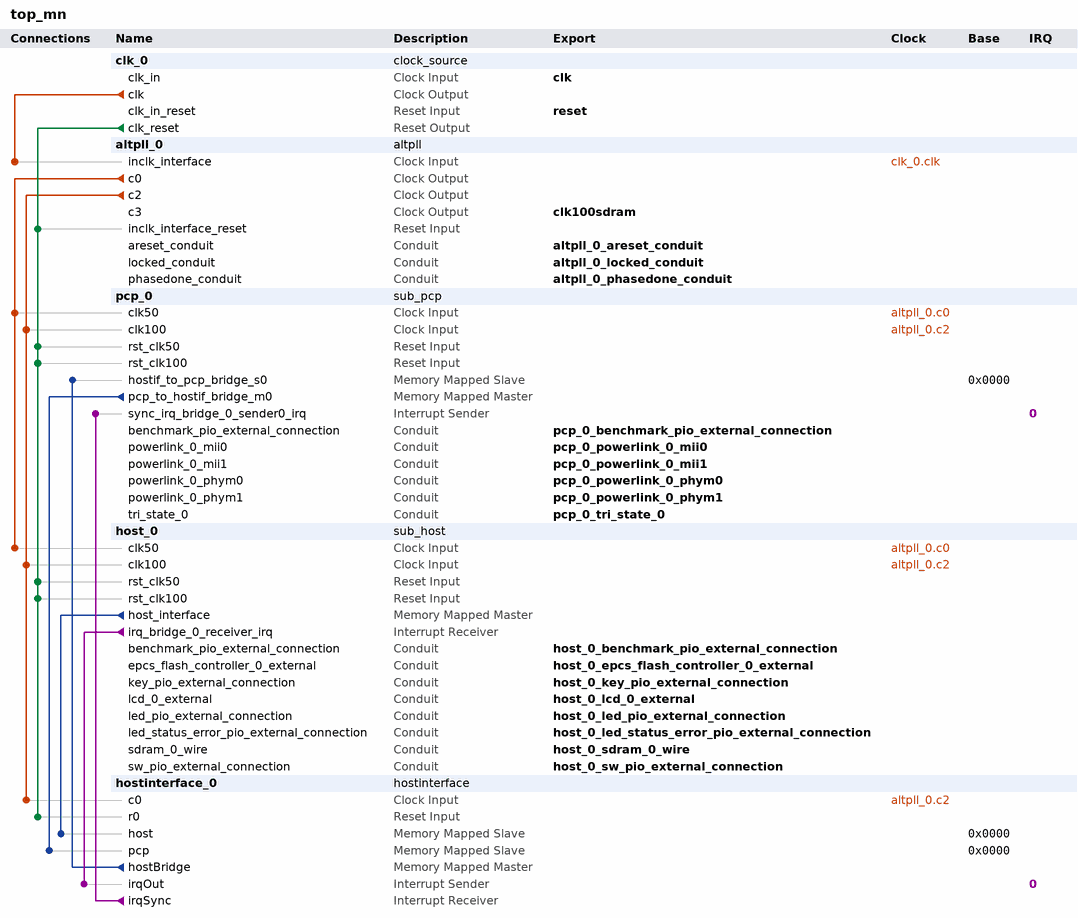
[diagram p0: system contents]
# Platform Designer (Qsys) system top_mn, Cyclone IV E EP4CE115F29C7
# Parameters at their usual value, and those the tool derives, are not listed.
package require -exact qsys 12.1
create_system top_mn
set_project_property DEVICE_FAMILY {Cyclone IV E}
set_project_property DEVICE EP4CE115F29C7

add_instance clk_0 clock_source 12.1
set_instance_parameter_value clk_0 clockFrequency 50000000

add_instance altpll_0 altpll 12.1
set_instance_parameter_value altpll_0 INCLK0_INPUT_FREQUENCY 20000
set_instance_parameter_value altpll_0 CLK0_MULTIPLY_BY 1
set_instance_parameter_value altpll_0 CLK2_MULTIPLY_BY 2
set_instance_parameter_value altpll_0 CLK3_MULTIPLY_BY 2
set_instance_parameter_value altpll_0 CLK0_DIVIDE_BY 1
set_instance_parameter_value altpll_0 CLK2_DIVIDE_BY 1
set_instance_parameter_value altpll_0 CLK3_DIVIDE_BY 1
set_instance_parameter_value altpll_0 CLK2_PHASE_SHIFT 0
set_instance_parameter_value altpll_0 CLK3_PHASE_SHIFT -1389
set_instance_parameter_value altpll_0 CLK2_DUTY_CYCLE 50
set_instance_parameter_value altpll_0 CLK3_DUTY_CYCLE 50
set_instance_parameter_value altpll_0 PORT_clk1 PORT_UNUSED
set_instance_parameter_value altpll_0 PORT_clk2 PORT_USED
set_instance_parameter_value altpll_0 PORT_clk3 PORT_USED
set_instance_parameter_value altpll_0 PORT_ARESET PORT_UNUSED
set_instance_parameter_value altpll_0 PORT_LOCKED PORT_USED

add_instance pcp_0 sub_pcp 1.0

add_instance host_0 sub_host 1.0

add_instance hostinterface_0 hostinterface 0.0.1
set_instance_parameter_value hostinterface_0 sys_uniqueId 0
set_instance_parameter_value hostinterface_0 gui_interfaceTyp 0
set_instance_parameter_value hostinterface_0 gui_parallelMltplx 0
set_instance_parameter_value hostinterface_0 gui_parallelDwidth 16
set_instance_parameter_value hostinterface_0 gui_sizeDynBuf0 2
set_instance_parameter_value hostinterface_0 gui_sizeDynBuf1 2
set_instance_parameter_value hostinterface_0 gui_sizeErrorCnter 3108
set_instance_parameter_value hostinterface_0 gui_sizeTxNmtQ 2
set_instance_parameter_value hostinterface_0 gui_sizeTxGenQ 2
set_instance_parameter_value hostinterface_0 gui_sizeTxSyncQ 2
set_instance_parameter_value hostinterface_0 gui_sizeTxVethQ 2
set_instance_parameter_value hostinterface_0 gui_sizeRxVethQ 1
set_instance_parameter_value hostinterface_0 gui_sizeK2UQ 8
set_instance_parameter_value hostinterface_0 gui_sizeU2KQ 8
set_instance_parameter_value hostinterface_0 gui_sizeTpdo 1024
set_instance_parameter_value hostinterface_0 gui_sizeRpdo 10240

# connections
add_connection altpll_0.c0 host_0.clk50 clock
add_connection altpll_0.c0 pcp_0.clk50 clock
add_connection altpll_0.c2 host_0.clk100 clock
add_connection altpll_0.c2 hostinterface_0.c0 clock
add_connection altpll_0.c2 pcp_0.clk100 clock
add_connection clk_0.clk altpll_0.inclk_interface clock
add_connection clk_0.clk_reset altpll_0.inclk_interface_reset reset
add_connection clk_0.clk_reset host_0.rst_clk50 reset
add_connection clk_0.clk_reset host_0.rst_clk100 reset
add_connection clk_0.clk_reset hostinterface_0.r0 reset
add_connection clk_0.clk_reset pcp_0.rst_clk50 reset
add_connection clk_0.clk_reset pcp_0.rst_clk100 reset
add_connection host_0.host_interface hostinterface_0.host avalon
set_connection_parameter_value host_0.host_interface/hostinterface_0.host baseAddress 0x0000
add_connection hostinterface_0.hostBridge pcp_0.hostif_to_pcp_bridge_s0 avalon
set_connection_parameter_value hostinterface_0.hostBridge/pcp_0.hostif_to_pcp_bridge_s0 baseAddress 0x0000
add_connection pcp_0.pcp_to_hostif_bridge_m0 hostinterface_0.pcp avalon
set_connection_parameter_value pcp_0.pcp_to_hostif_bridge_m0/hostinterface_0.pcp baseAddress 0x0000
add_connection host_0.irq_bridge_0_receiver_irq hostinterface_0.irqOut interrupt
set_connection_parameter_value host_0.irq_bridge_0_receiver_irq/hostinterface_0.irqOut irqNumber 0
add_connection hostinterface_0.irqSync pcp_0.sync_irq_bridge_0_sender0_irq interrupt
set_connection_parameter_value hostinterface_0.irqSync/pcp_0.sync_irq_bridge_0_sender0_irq irqNumber 0

# exported interfaces
add_interface clk clock sink
set_interface_property clk EXPORT_OF clk_0.clk_in
add_interface reset reset sink
set_interface_property reset EXPORT_OF clk_0.clk_in_reset
add_interface clk100sdram clock source
set_interface_property clk100sdram EXPORT_OF altpll_0.c3
add_interface altpll_0_areset_conduit conduit end
set_interface_property altpll_0_areset_conduit EXPORT_OF altpll_0.areset_conduit
add_interface altpll_0_locked_conduit conduit end
set_interface_property altpll_0_locked_conduit EXPORT_OF altpll_0.locked_conduit
add_interface altpll_0_phasedone_conduit conduit end
set_interface_property altpll_0_phasedone_conduit EXPORT_OF altpll_0.phasedone_conduit
add_interface pcp_0_tri_state_0 conduit end
set_interface_property pcp_0_tri_state_0 EXPORT_OF pcp_0.tri_state_0
add_interface pcp_0_benchmark_pio_external_connection conduit end
set_interface_property pcp_0_benchmark_pio_external_connection EXPORT_OF pcp_0.benchmark_pio_external_connection
add_interface host_0_sw_pio_external_connection conduit end
set_interface_property host_0_sw_pio_external_connection EXPORT_OF host_0.sw_pio_external_connection
add_interface host_0_key_pio_external_connection conduit end
set_interface_property host_0_key_pio_external_connection EXPORT_OF host_0.key_pio_external_connection
add_interface host_0_led_pio_external_connection conduit end
set_interface_property host_0_led_pio_external_connection EXPORT_OF host_0.led_pio_external_connection
add_interface host_0_lcd_0_external conduit end
set_interface_property host_0_lcd_0_external EXPORT_OF host_0.lcd_0_external
add_interface host_0_epcs_flash_controller_0_external conduit end
set_interface_property host_0_epcs_flash_controller_0_external EXPORT_OF host_0.epcs_flash_controller_0_external
add_interface host_0_sdram_0_wire conduit end
set_interface_property host_0_sdram_0_wire EXPORT_OF host_0.sdram_0_wire
add_interface host_0_benchmark_pio_external_connection conduit end
set_interface_property host_0_benchmark_pio_external_connection EXPORT_OF host_0.benchmark_pio_external_connection
add_interface pcp_0_powerlink_0_phym0 conduit end
set_interface_property pcp_0_powerlink_0_phym0 EXPORT_OF pcp_0.powerlink_0_phym0
add_interface pcp_0_powerlink_0_phym1 conduit end
set_interface_property pcp_0_powerlink_0_phym1 EXPORT_OF pcp_0.powerlink_0_phym1
add_interface pcp_0_powerlink_0_mii0 conduit end
set_interface_property pcp_0_powerlink_0_mii0 EXPORT_OF pcp_0.powerlink_0_mii0
add_interface pcp_0_powerlink_0_mii1 conduit end
set_interface_property pcp_0_powerlink_0_mii1 EXPORT_OF pcp_0.powerlink_0_mii1
add_interface host_0_led_status_error_pio_external_connection conduit end
set_interface_property host_0_led_status_error_pio_external_connection EXPORT_OF host_0.led_status_error_pio_external_connection

save_system top_mn.qsys
